# EAGLE design MADpassLightV2 (EAGLE 9.5.1)
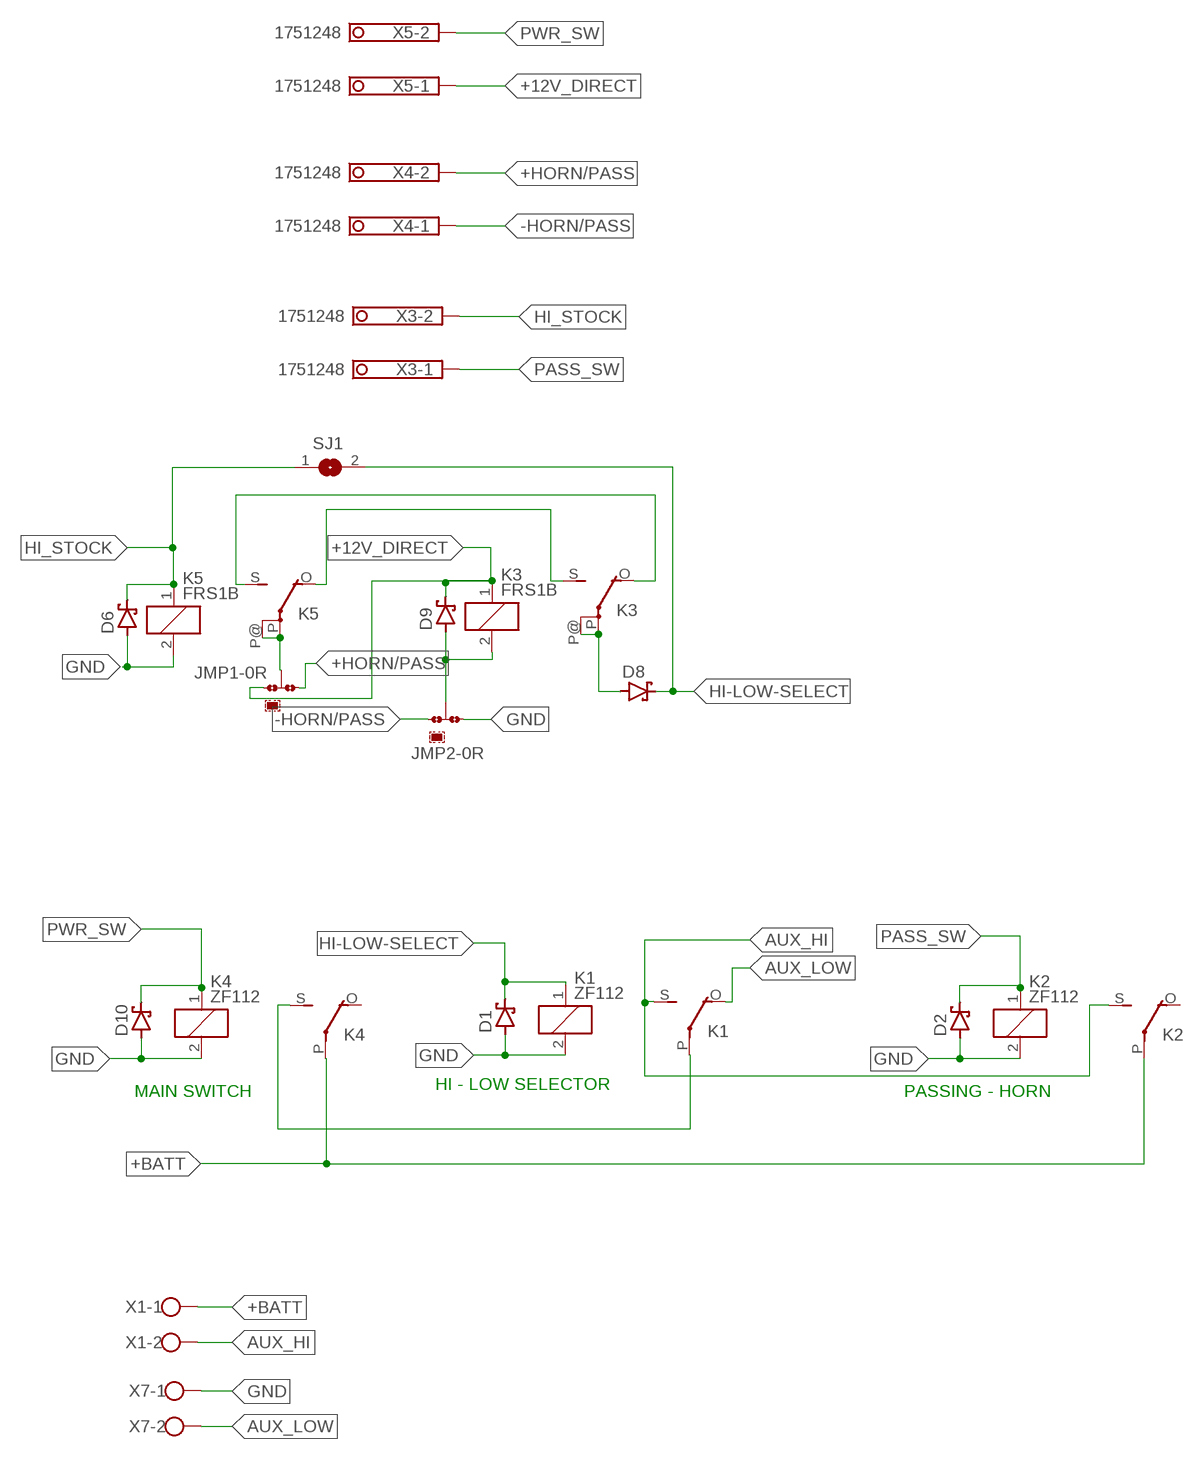
[diagram p0: schematic, sheet 1]

## Parts
D1  SCHOTTKY-DIODESMD  [SMB]
D2  SCHOTTKY-DIODESMD  [SMB]
D6  SCHOTTKY-DIODESMD  [SMB]
D8  SCHOTTKY-DIODESMD  [SMB]
D9  SCHOTTKY-DIODESMD  [SMB]
D10  SCHOTTKY-DIODESMD  [SMB]
JMP1  0R-JUMPA  [A0R-JMP]
JMP2  0R-JUMPA  [A0R-JMP]
K1  ZF112  [ZF112]
K2  ZF112  [ZF112]
K3  FRS1B  [FRS1B]
K4  ZF112  [ZF112]
K5  FRS1B  [FRS1B]
SJ1  SJ  [SJ]
X1  W237-102  [W237-102]
X3  1751248  [1751248]
X4  1751248  [1751248]
X5  1751248  [1751248]
X7  W237-102  [W237-102]

## Nets
+12V_DIRECT: D9.C JMP1.1 K3.1 X5.1
+BATT: K2.P(2:P) K4.P(2:P) X1.1
+HORN/PASS: JMP1.3 X4.2
-HORN/PASS: JMP2.1 X4.1
AUX: D8.A K3.P(2:P) K3.P@(2:P)
AUX_HI: K1.S(2:S) K2.S(2:S) X1.2
AUX_LOW: K1.O(2:O) X7.2
GND: D1.A D2.A D6.A D10.A JMP2.3 K1.2 K2.2 K4.2 K5.2 X7.1
HI-LOW-SELECT: D1.C D8.C K1.1 SJ1.2
HI_STOCK: D6.C K5.1 SJ1.1 X3.2
N$1: K1.P(2:P) K4.S(2:S)
N$2: K3.S(2:S) K5.O(2:O)
N$3: D9.A JMP2.2 K3.2
N$4: JMP1.2 K5.P(2:P) K5.P@(2:P)
N$5: K3.O(2:O) K5.S(2:S)
PASS_SW: D2.C K2.1 X3.1
PWR_SW: D10.C K4.1 X5.2
Unconnected: K2.O(2:O) K4.O(2:O)

## Notes on the sheet
- HI - LOW SELECTOR
- MAIN SWITCH | PASSING - HORN

## Library data of the parts
D1 D2 D6 D8-D10 = diode:SCHOTTKY-DIODE: Schottky Diode
JMP1 JMP2 = jump-0r-smd:0R-JUMP: SMD 0R 0805 Jumper
K1 K2 K4 = relay:ZF112: RELAY 1 x switch; OC_FARNELL: unknown; OC_NEWARK: unknown
K3 K5 = relay:FRS1B: RELAY 1 x switch, same as V23101-D6-A201, Siemens; OC_FARNELL: unknown; OC_NEWARK: unknown
SJ1 = jumper:SJ: SMD solder JUMPER
X1 X7 = con-wago-500:W237-102: WAGO SCREW CLAMP; MPN: 237-102; OC_FARNELL: unknown; OC_NEWARK: 70K9898
X3-X5 = con-phoenix-350:1751248: MKDS 1/ 2-3,5 Printklemme Nennstrom: 10 A Bemessungsspannung: 160 V Raster: 3,5 mm Polzahl: 2 Montageart: Löten Anschlussart: Schraubanschluss Anschlussrichtung vom Leiter zur Platine: 0° Source: http://eshop.phoenixcontact.com .. 1751248.pdf; OC_FARNELL: unknown; OC_NEWARK: unknown

## Board
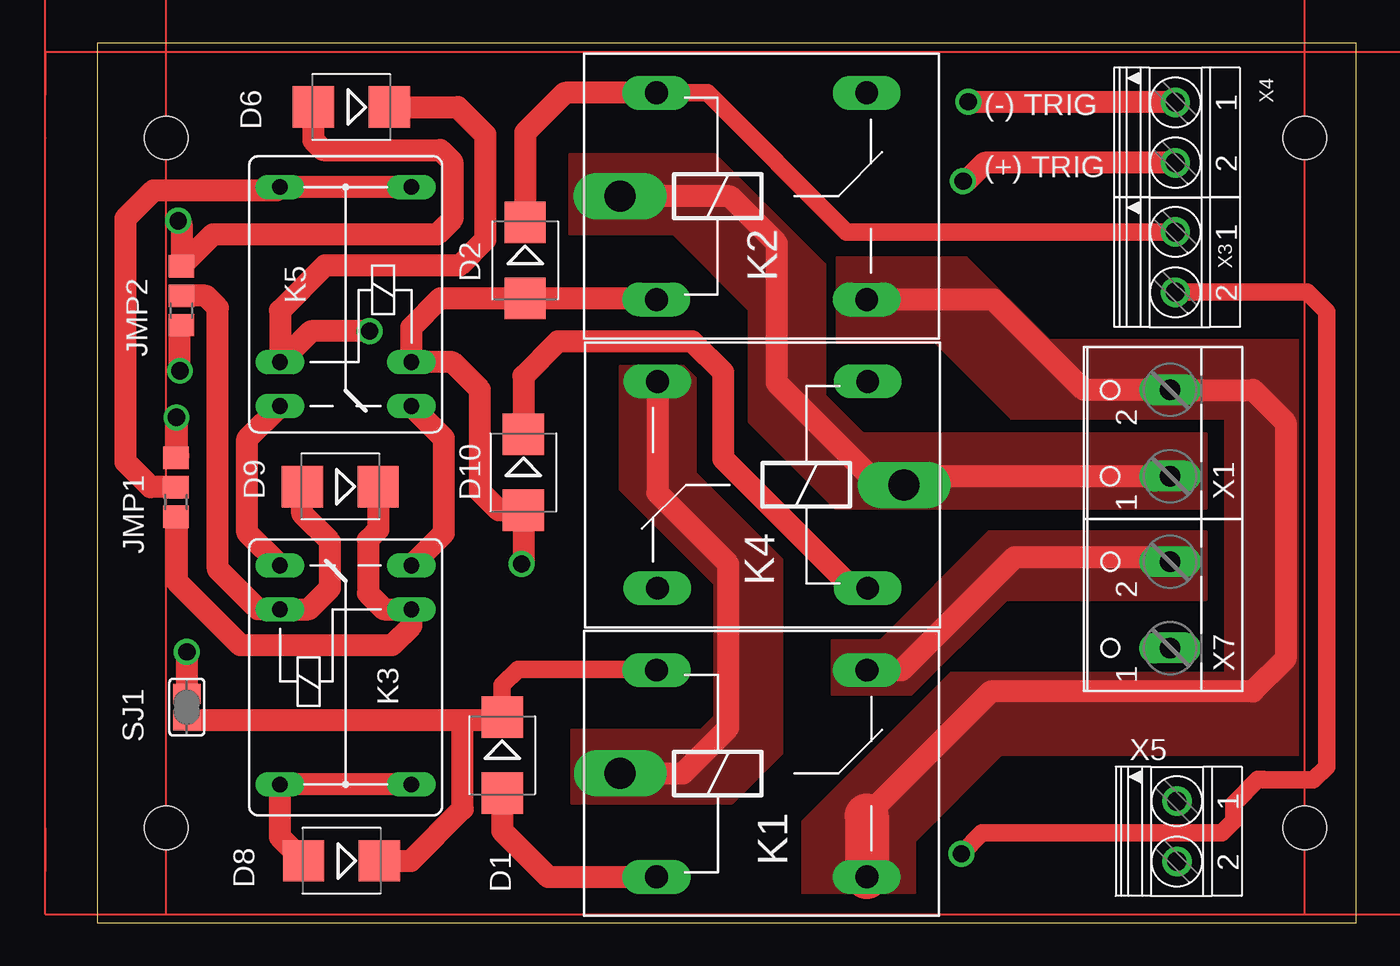
[diagram p1: board, top side]
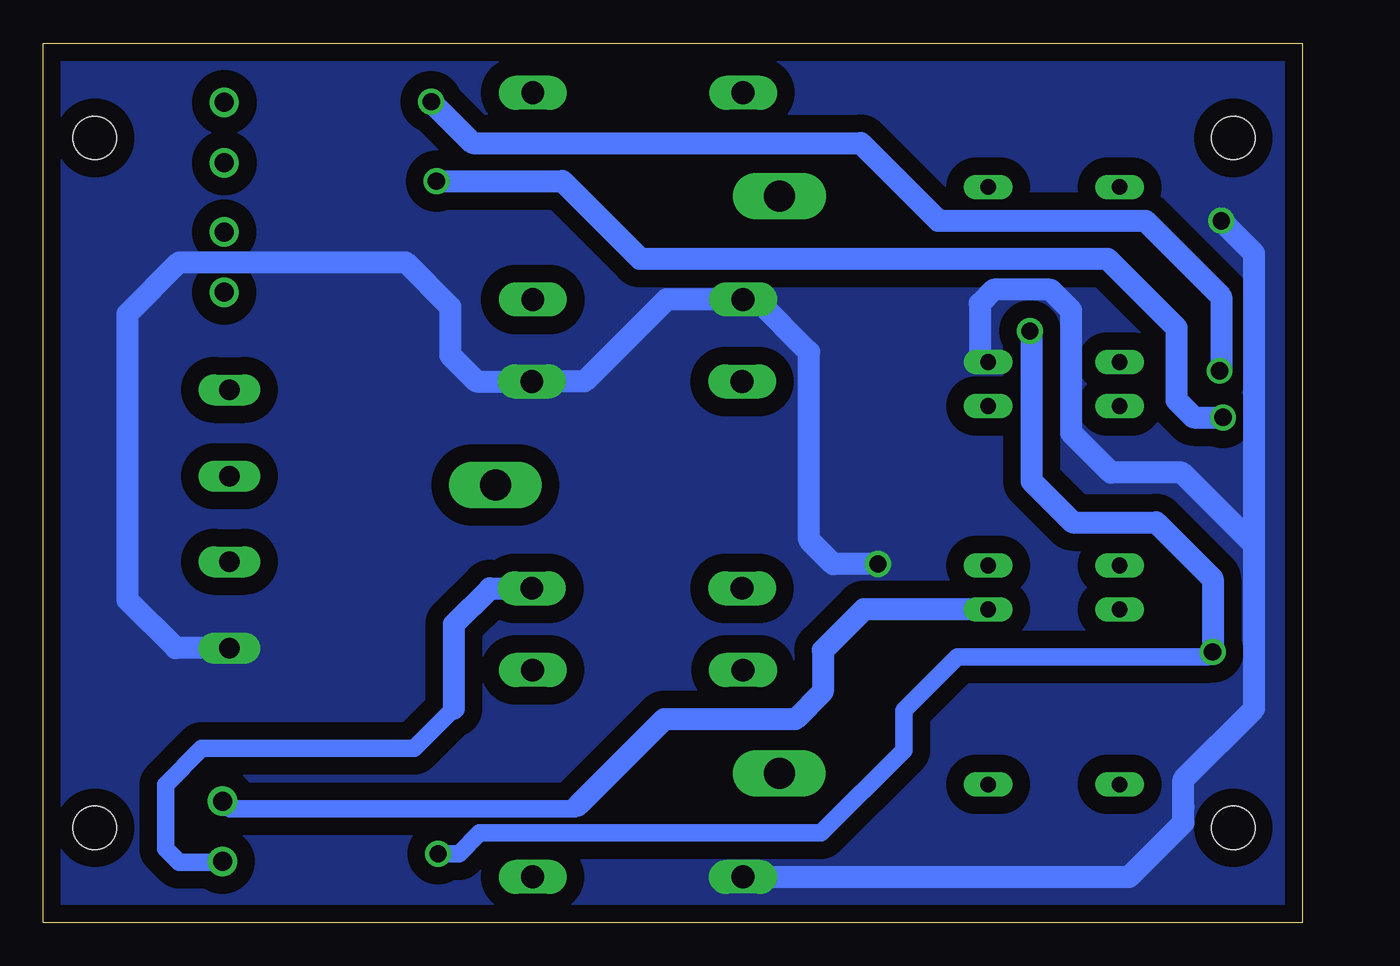
[diagram p2: board, bottom side, seen from below]

Size 73 x 51 mm. Coordinates in mm from the lower left corner, seen from the top.
Outline: 0,0 73,0 73,51 0,51 0,0
Copper layers (1*16): Top 0.035mm / dielectric 1.5mm / Bottom 0.035mm
Design rules "default": minimum track width 6mil, minimum drill 0.35mm, track to track 6mil, track to pad 6mil, pad to pad 6mil, via to via 6mil, smd to smd 6mil, copper to edge 40mil, drill to drill 6mil, minimum pad ring 10mil, minimum via ring 8mil, stop-mask expansion 4mil, vias tented up to drill 0mil, thermal gap 10mil
Holes 2.5 mm at 4,45.5 70,45.5 70,5.5 4,5.5

### Footprints (pad centres in the part's own frame; a part is rotated, then mirrored left to right if it is on the bottom)
SMB = smd 2.4 x 2.4: A 2.2,0; C -2.2,0
A0R-JMP = smd 1.5 x 1.3: 1 0,1.7; 2 0,0; 3 0,-1.7
ZF112 = drill 1.321 long: 1 -6.096,5.994; 2 -6.096,-5.994; O 6.096,5.994; S 6.096,-5.994 | drill 1.803 long: P -8.204,0
FRS1B = drill 0.914 long: 1 0,3.81; 2 0,-3.81; O -2.54,-3.81; P 10.16,3.81; P@ 10.16,-3.81; S -2.54,3.81
SJ = smd 1.168 x 1.6: 1 -0.762,0; 2 0.762,0
W237-102 = drill 1.194 long: 1 -2.5,-1.27; 2 2.5,-1.27
1751248 = drill 1.1 pad 1.7: 1 -1.75,-0.1; 2 1.75,-0.1

### Placement (x,y rotation side)
D1  23.48,9.71 270 top
D2  24.81,38.41 270 top
D6  14.73,47.29 180 top
D8  14.17,3.59 180 top
D9  14.09,25.29 180 top
D10  24.71,26.11 270 top
JMP1  4.57,25.25 180 top
JMP2  4.89,36.35 180 top
K1  38.52,8.65 0 top
K2  38.52,42.13 0 top
K3  14.41,18.17 270 top
K4  38.58,25.39 180 top
K5  14.41,32.5 90 top
SJ1  5.2,12.5 270 top
X1  60.93,28.39 90 top
X3  62.6,38.3 270 top
X4  62.6,45.81 270 top
X5  62.7,5.3 270 top
X7  60.94,18.43 90 top

### Tracks (layer width: path | path; a pad name or v marks a point on that pad's centre or on a via)
+12V_DIRECT
  Top 1.27: D9.C 16.29,22.79 15.7,22.2 15.7,19.1 16.63,18.17 K3.1 18.22,17.22 17.1,16.1 8.3,16.1 4.6,19.8 4.6,23.52 JMP1.1
  Bottom 1.016: 42,6.8 42.2,6.6 62.15,6.6 X5.1
  Bottom 1.27: K3.1 25.43,18.17 27.8,15.8 27.8,13.4 29.4,11.8 37,11.8 42,6.8
+BATT
  Top 1.27: K2.P 36.67,42.12 39.4,39.4 39.4,31.3 45.31,25.39 K4.P 47.28,25.89 X1.1
  pour Top (no thermals): 64.3,28.4 64.3,24 42.8,24 37.8,29 37.8,35.5 33.4,39.9 27.4,39.9 27.4,44.6 35.8,44.6 42.2,38.2 42.2,30.6 44.4,28.4
+HORN/PASS  (via drill 1)
  Top 1.27: JMP1.3 4.7,27.08 4.6,27.18 v4.6,29.3 | X4.2 51.46,44.06 50.4,43 v50.2,43
  Bottom 1.27: v50.2,43 42.9,43 38.4,38.5 11.3,38.5 7.3,34.5 7.3,30.3 6.3,29.3 v4.6,29.3
-HORN/PASS  (via drill 1)
  Top 1.27: X4.1 50.54,47.56 v50.5,47.6 | v4.8,32 4.8,34.56 JMP2.1
  Bottom 1.27: v4.8,32 4.7,32.1 4.7,36.3 9.1,40.7 21.1,40.7 25.6,45.2 48.1,45.2 v50.5,47.6
AUX
  Top 1.27: K3.P K3.P@ 10.6,4.96 D8.A
AUX_HI
  Top 1.27: 44.62,6.22 51.8,13.4 67,13.4 68.9,15.3 68.9,29 67.01,30.89 X1.2 57.21,30.89 51.97,36.13 K2.S
  Top 2.54: 44.62,6.22 K1.S
  pour Top (isolate 0.254, no thermals): 40.9,1.7 40.9,5.9 49.5,14.5 65.4,14.5 65.4,29.2 53,29.2 48.6,33.6 42.9,33.6 42.9,38.6 50.4,38.6 55.2,33.8 69.9,33.8 69.9,9.7 52.4,9.7 47.4,4.7 47.4,1.7
AUX_LOW
  Top 1.27: K1.O 46.65,14.64 53.2,21.2 61.94,21.2 X7.2
  pour Top (no thermals): 42.6,16.4 45.4,16.4 51.7,22.7 64.3,22.7 64.3,18.7 52.7,18.7 47.2,13.2 42.6,13.2
GND  (via drill 1)
  Top 1.27: D1.A 23.48,5.32 26.14,2.66 K1.2 | K2.2 32.34,36.21 D2.A 19.91,36.21 18.22,34.52 K5.2 20.6,32.5 22.2,30.9 22.2,25 23.29,23.91 D10.A 24.71,20.91 v24.6,20.8 | D6.A 12.53,45.37 13.1,44.8 19.9,44.8 20.6,44.1 20.6,40.8 19.7,39.9 6.7,39.9 4.89,38.09 | 4.89,38.09 JMP2.3 | v4.7,40.7 4.89,40.51 4.89,38.09
  Bottom 1.27: v24.6,20.8 27.2,20.8 28.6,22.2 28.6,33.1 31.63,36.13 K2.2 36.87,36.13 41.62,31.39 K4.2 47.88,31.39 49.4,32.9 49.4,35.7 52,38.3 65.1,38.3 68.1,35.3 68.1,18.7 65.33,15.93 X7.1 | K1.2 10.04,2.66 6.9,5.8 6.9,6.7 6.9,8.3 2.8,12.4 2.8,21.9 | K5.2 18.7,32.98 18.7,35.9 17.9,36.7 14.6,36.7 13.4,35.5 13.4,28.4 11.1,26.1 7,26.1 2.8,21.9 | 2.8,21.9 2.8,38.8 v4.7,40.7
  pour Bottom (isolate 1.016, no thermals): 0.2,50.8 72.8,50.8 72.8,0.2 0.2,0.2
HI-LOW-SELECT
  Top 1.016: D1.C 23.48,13.78 24.4,14.7 32.37,14.7 K1.1
  Top 1.27: D8.C 18.19,3.59 21.2,6.6 21.2,11.74 | 21.2,11.74 SJ1.2 | D1.C 23.31,11.74 21.2,11.74
HI_STOCK  (via drill 1)
  Top 1.016: X3.2 70.15,36.55 71.28,35.42 71.28,9.05 70.5,8.27 67.63,8.27 67.6,8.3 67.3,8.3 65.9,6.9 65.9,5.9 65.2,5.2 51.3,5.2 v50.1,4
  Top 1.27: D6.C 20.91,47.29 22.5,45.7 22.5,39.6 21,38.1 13.2,38.1 10.6,35.5 K5.1 12.4,34.3 v15.8,34.3 | v5.2,15.7 SJ1.1
  Bottom 1.016: v50.1,4 48.9,4 47.7,5.2 27.9,5.2 23.1,10 23.1,12.3 20,15.4 5.5,15.4 v5.2,15.7
  Bottom 1.27: v15.8,34.3 15.7,34.2 15.7,25.6 13.31,23.21 8.47,23.21 5.2,19.94 v5.2,15.7
N$1
  Top 1.27: K1.P 33.95,8.65 36.6,11.3 36.6,20.8 32.48,24.92 K4.S
  pour Top (no thermals): 30.3,32.3 34,32.3 34.7,31.6 34.7,26.1 39.7,21.1 39.7,9.8 36.8,6.9 27.5,6.9 27.5,11.2 35,11.2 35.8,12 35.8,19.6 30.3,25.1
N$2
  Top 1.27: K3.S 20.1,22.59 20.1,28.08 K5.O
N$3
  Top 1.27: D9.A 11.89,23.71 13.5,22.1 13.5,19.4 12.27,18.17 K3.2 9.33,18.17 7,20.5 7,35.65 6.3,36.35 JMP2.2
N$4
  Top 1.27: JMP1.2 3.1,25.25 1.65,26.7 1.65,40.85 3.26,42.46 10.4,42.46 K5.P K5.P@
N$5
  Top 1.27: K3.O 8.7,22.61 8.7,28.06 K5.S
PASS_SW
  Top 1.016: K2.1 35.38,48.12 43.45,40.05 X3.1
  Top 1.27: K2.1 27.12,48.12 24.81,45.81 D2.C
PWR_SW
  Top 1.27: K4.1 43.8,19.4 36.3,26.9 36.3,31.9 34.5,33.7 26.7,33.7 24.71,31.71 D10.C
  Bottom 1.016: 49.2,12.4 51.5,10.1 63.8,10.1 65.9,8 65.9,4.3 65.1,3.5 62.65,3.5 X5.2
  Bottom 1.27: 49.2,12.4 49.2,17.3 47.1,19.4 K4.1
(copper drawn outside any net)
  shapes: Top area x6

### Text on the board
tNames: (-) TRIG | (+) TRIG